# Altium schematic sheet VTM Ethernet Module.SchDoc
size A4; SheetNumber: 1; SheetTotal: 1
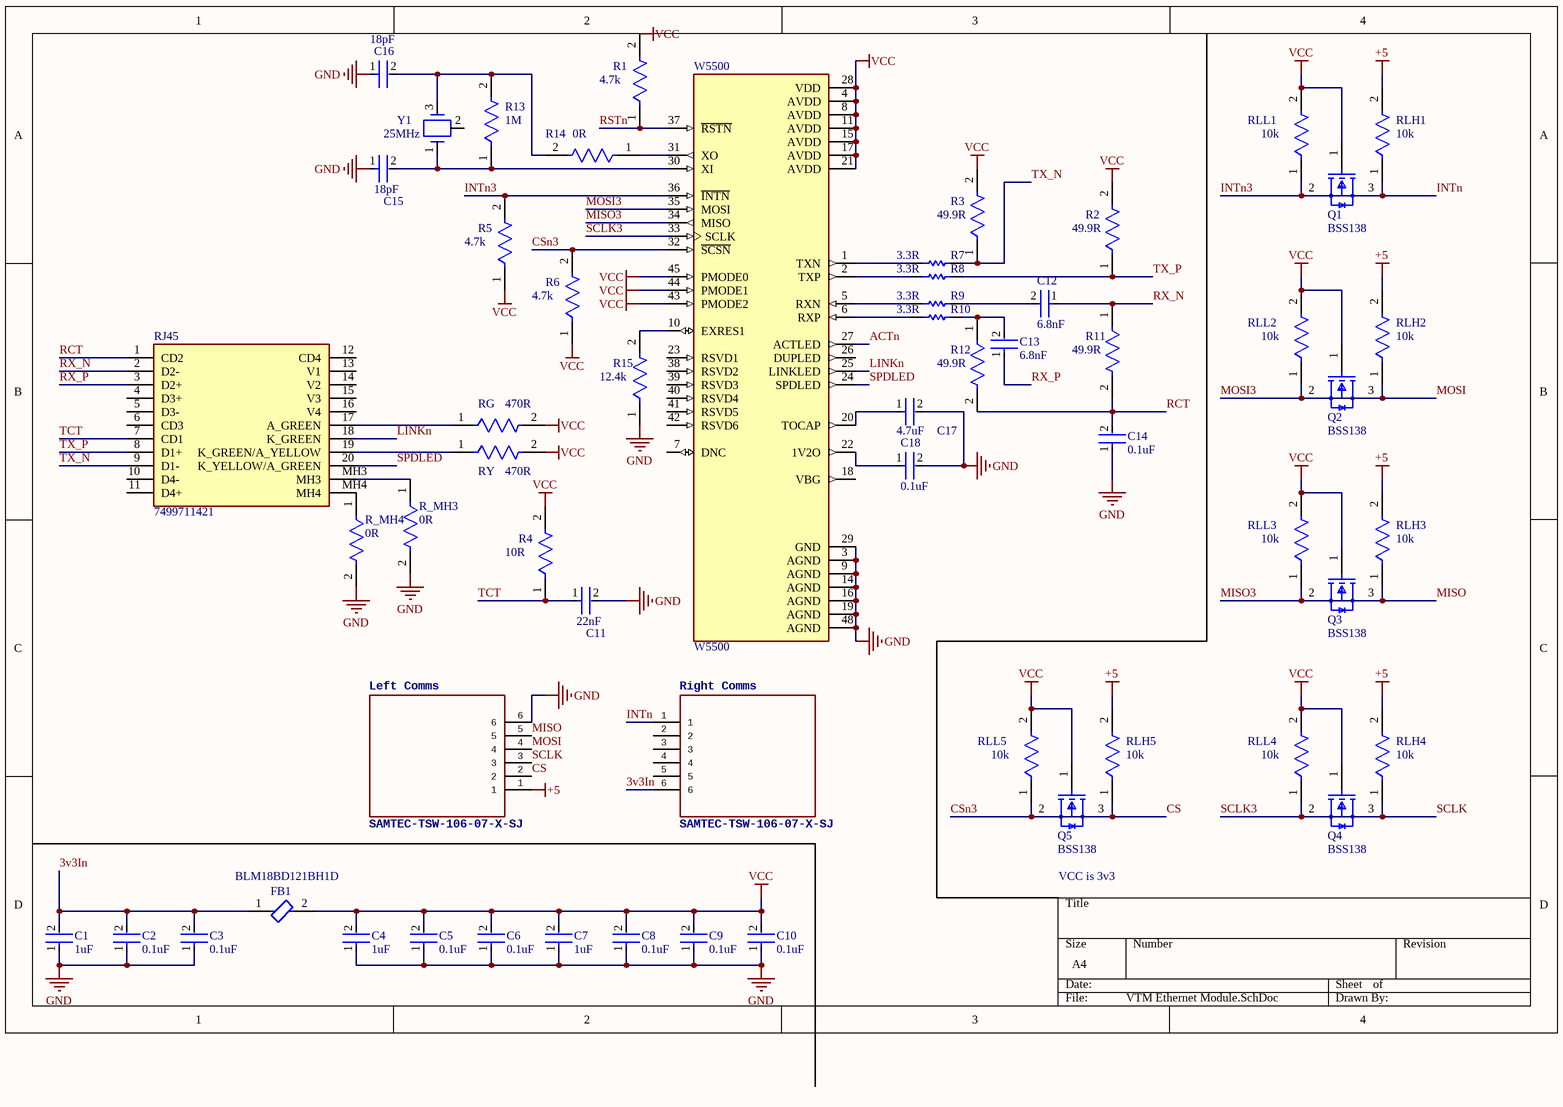
[diagram p0: VTM Ethernet Module.SchDoc]

## Parts
C1  1uF  [FP-C0805C-DN-MFG]
C2  0.1uF  [FP-C0805C-DN-MFG]
C3  0.1uF  [FP-C0805C-DN-MFG]
C4  1uF  [FP-C0805C-DN-MFG]
C5  0.1uF  [FP-C0805C-DN-MFG]
C6  0.1uF  [FP-C0805C-DN-MFG]
C7  1uF  [FP-C0805C-DN-MFG]
C8  0.1uF  [FP-C0805C-DN-MFG]
C9  0.1uF  [FP-C0805C-DN-MFG]
C10  0.1uF  [FP-C0805C-DN-MFG]
C11  22nF  [FP-C0805C-DN-MFG]
C12  6.8nF  [FP-C0805C-DN-MFG]
C13  6.8nF  [FP-C0805C-DN-MFG]
C14  0.1uF  [FP-C0805C-DN-MFG]
C15  18pF  [FP-C0805C-DN-MFG]
C16  18pF  [FP-C0805C-DN-MFG]
C17  4.7uF  [FP-C0805C-DN-MFG]
C18  0.1uF  [FP-C0805C-DN-MFG]
FB1  BLM18BD121BH1D  [FP-BLM18-0_15-t0_8-MFG]
Left_Comms  SAMTEC-TSW-106-07-X-SJ  [SAMTEC-TSW-106-07-X-S]
Q1  BSS138  [FP-318-08-IPC_B]
Q2  BSS138  [FP-318-08-IPC_B]
Q3  BSS138  [FP-318-08-IPC_B]
Q4  BSS138  [FP-318-08-IPC_B]
Q5  BSS138  [FP-318-08-IPC_B]
R1  4.7k  [FP-CPF0805-MFG]
R2  49.9R  [FP-CPF0805-MFG]
R3  49.9R  [FP-CPF0805-MFG]
R4  10R  [FP-CPF0805-MFG]
R5  4.7k  [FP-CPF0805-MFG]
R6  4.7k  [FP-CPF0805-MFG]
R7  3.3R  [RESC3216X70X50LL05T20]
R8  3.3R  [RESC3216X70X50LL05T20]
R9  3.3R  [RESC3216X70X50LL05T20]
R10  3.3R  [RESC3216X70X50LL05T20]
R11  49.9R  [FP-CPF0805-MFG]
R12  49.9R  [FP-CPF0805-MFG]
R13  1M  [FP-CPF0805-MFG]
R14  0R  [FP-CPF0805-MFG]
R15  12.4k  [FP-CPF0805-MFG]
R_MH3  0R  [FP-CPF0805-MFG]
R_MH4  0R  [FP-CPF0805-MFG]
RG  470R  [FP-CPF0805-MFG]
Right_Comms  SAMTEC-TSW-106-07-X-SJ  [SAMTEC-TSW-106-07-X-S]
RJ45  7499711421  [7499711421]
RLH1  10k  [FP-CPF0805-MFG]
RLH2  10k  [FP-CPF0805-MFG]
RLH3  10k  [FP-CPF0805-MFG]
RLH4  10k  [FP-CPF0805-MFG]
RLH5  10k  [FP-CPF0805-MFG]
RLL1  10k  [FP-CPF0805-MFG]
RLL2  10k  [FP-CPF0805-MFG]
RLL3  10k  [FP-CPF0805-MFG]
RLL4  10k  [FP-CPF0805-MFG]
RLL5  10k  [FP-CPF0805-MFG]
RY  470R  [FP-CPF0805-MFG]
W5500  W5500  [QFP50P900X900X160-48N]
Y1  25MHz  [ECS-4X-3IL]

## Nets
+5: Left_Comms.1 RLH1.2 RLH2.2 RLH3.2 RLH4.2 RLH5.2
GND: C1.1 C2.1 C3.1 C4.1 C5.1 C6.1 C7.1 C8.1 C9.1 C10.1 C11.2 C14.1 C15.1 C16.1 C17.2 C18.2 Left_Comms.6 R15.1 R_MH3.2 R_MH4.2 W5500.3(AGND) W5500.9(AGND) W5500.14(AGND) W5500.16(AGND) W5500.19(AGND) W5500.29(GND) W5500.48(AGND)
VCC: C4.2 C5.2 C6.2 C7.2 C8.2 C9.2 C10.2 FB1.2 Q1.1(G) Q2.1(G) Q3.1(G) Q4.1(G) Q5.1(G) R1.2 R2.2 R3.2 R4.2 R5.1 R6.1 RG.2 RLL1.2 RLL2.2 RLL3.2 RLL4.2 RLL5.2 RY.2 W5500.4(AVDD) W5500.8(AVDD) W5500.11(AVDD) W5500.15(AVDD) W5500.17(AVDD) W5500.21(AVDD) W5500.28(VDD) W5500.43(PMODE2) W5500.44(PMODE1) W5500.45(PMODE0)
3v3In: C1.2 C2.2 C3.2 FB1.1 Right_Comms.6
ACTn: W5500.27(ACTLED)
CS: Left_Comms.2 Q5.2(S) Q5.3(D) R6.2 RLH5.1 RLL5.1 W5500.32(~{SCSN})  [also labelled CSn3]
INTn: Q1.2(S) Q1.3(D) R5.2 Right_Comms.1 RLH1.1 RLL1.1 W5500.36(~{INTN})  [also labelled INTn3]
LINKn: RJ45.18(K_GREEN) W5500.25(LINKLED)
MISO: Left_Comms.5 Q3.2(S) Q3.3(D) RLH3.1 RLL3.1 W5500.34(MISO)  [also labelled MISO3]
MOSI: Left_Comms.4 Q2.2(S) Q2.3(D) RLH2.1 RLL2.1 W5500.35(MOSI)  [also labelled MOSI3]
RCT: C14.2 R11.2 R12.2 RJ45.1(CD2)
RSTn: R1.1 W5500.37(~{RSTN})
RX_N: C12.1 R11.1 RJ45.2(D2-)
RX_P: C13.1 RJ45.3(D2+)
SCLK: Left_Comms.3 Q4.2(S) Q4.3(D) RLH4.1 RLL4.1 W5500.33(SCLK)  [also labelled SCLK3]
SPDLED: RJ45.20(K_YELLOW/A_GREEN) W5500.24(SPDLED)
TCT: C11.1 R4.1 RJ45.7(CD1)
TX_N: R3.1 R7.2 RJ45.9(D1-)
TX_P: R2.1 R8.2 RJ45.8(D1+)
NetC12_2: C12.2 R9.2
NetC13_2: C13.2 R10.2 R12.1
NetC15_2: C15.2 R13.1 W5500.30(XI) Y1.1
NetC16_2: C16.2 R13.2 R14.2 Y1.3
NetC17_1: C17.1 W5500.20(TOCAP)
NetC18_1: C18.1 W5500.22(1V2O)
NetR7_1: R7.1 W5500.1(TXN)
NetR8_1: R8.1 W5500.2(TXP)
NetR9_1: R9.1 W5500.5(RXN)
NetR10_1: R10.1 W5500.6(RXP)
NetR14_1: R14.1 W5500.31(XO)
NetR15_2: R15.2 W5500.10(EXRES1)
NetR_MH3_1: R_MH3.1 RJ45.MH3
NetR_MH4_1: R_MH4.1 RJ45.MH4
NetRG_1: RG.1 RJ45.17(A_GREEN)
NetRJ45_19: RJ45.19(K_GREEN/A_YELLOW) RY.1

Not connected (* = marked no-connect by the designer): Right_Comms 2 3 4 5; RJ45 4(D3+) 5(D3-) 6(CD3) 10(D4-) 11(D4+) 12(CD4) 13(V1) 14(V2) 15(V3) 16(V4); W5500 7(DNC) 18(VBG) 23(RSVD1) 26(DUPLED) 38(RSVD2) 39(RSVD3) 40(RSVD4) 41(RSVD5) 42(RSVD6); Y1 2

## Notes on the sheet
- VCC is 3v3

## Library data of the parts
C1-C18 = CMP-1036-01133-2: CAP CER 18PF 25V 20% NP0 0805; Manufacturer Part Number: C0805C180M3GACTU; Manufacturer: KEMET; Material: Ceramic; Temperature Characteristic: C0G; Tolerance: 0.2; Temperature Coefficient: 30ppm/°C; Automotive: No; Temperature: -55°C to +125°C; Package: C0805C-DN; Device Class L3: Ceramic Capacitors; Capacitance: 18 pF; Octopart: https://octopart.com/c0805c180m3gactu-kemet-17137232; ComponentLink2Description: Datasheet; RoHS: TRUE; Device Class L1: Passive Components; Voltage Rating: 25 V; Height: 0.88mm; Ipc Land Pattern Name: CAPC200125X78; Device Class L2: Capacitors; Mouser Description: Multilayer Ceramic Capacitors MLCC - SMD/SMT 25volts 18pF C0G 20%; Category: Cap; Temperature Range High: +125°C; Temperature Range Low: -55°C; Lead Free: Yes; Digikey Description: CAP CER 18PF 25V 20% NP0 0805; Value: 18 pF; ComponentLink2URL: https://content.kemet.com/datasheets/KEM_C1003_C0G_SMD.pdf
FB1 = CMP-06046-002548-1: Chip Ferrite Bead, 0603, 120Ω @ 100MHz, 0.4Ω, 25%, 300mA; Number of Lines: 1; DC Resistance (DCR): 400mR; Case/Package: 0603; Max Current Rating: 300mA; Ratings: AEC-Q200; Case Code (Metric): 1608; Min Operating Temperature: -55°C; Max Operating Temperature: 150°C; Case Code (Imperial): 0603; RoHS Compliant: Yes
Q1-Q5 = CMP-07173-000101-1: MOSFET N-CH 50V 220MA SOT-23; Turn-Off Delay Time: 20ns; Element Configuration: Single; Rds On Max: 3.5R; Gate to Source Voltage (Vgs): 20V; Threshold Voltage: 1.3V; Number of Elements: 1; Power Dissipation: 360mW; Rise Time: 9ns; Turn-On Delay Time: 2.5ns; Input Capacitance: 27pF; On-State Resistance: 6R; Lead Free: Lead Free; Length: 2.92mm; Width: 1.3mm; Drain to Source Breakdown Voltage: 50V; Min Operating Temperature: -55°C; REACH SVHC: No SVHC; Packaging: Tape and Reel; Radiation Hardening: No; Height: 0.93mm; Drain to Source Voltage (Vdss): 50V; Current Rating: 220mA; Voltage Rating (DC): 50V; Weight: 0.03g; Continuous Drain Current (ID): 220mA; Number of Pins: 3; Nominal Vgs: 1.3V; Max Power Dissipation: 360mW; Fall Time: 9ns; Drain to Source Resistance: 3.5R; Contact Plating: Tin; Case/Package: SOT-23; Package Quantity: 1; Dual Supply Voltage: 50V; Mount: Surface Mount; Termination: SMD/SMT; Max Operating Temperature: 150°C
R1-R6 R11-R15 R_MH3 R_MH4 RG RLH1-RLH5 RLL1-RLL5 RY = CMP-03211-011426-1: RES SMD 1.6M OHM 0.1% 1/10W 0805; Resistance: 1.6MR; Voltage Rating: 100V; Temperature Coefficient: 25ppm/°C; Max Power Dissipation: 100mW; Number of Resistors: 1; Length: 2mm; Number of Terminations: 2; Resistor Type: Thin Film; Weight: 0.000194oz; Case Code (Imperial): 0805; Series: CPF, Neohm; RoHS Compliant: Yes; Width: 1.25mm; Mount: Surface Mount; Package Quantity: 1000; Height: 0.55mm; Case/Package: 0805; Min Operating Temperature: -55°C; Termination: Solder; ELV: Compliant; Packaging: Tape and Reel; Case Code (Metric): 2012; Tolerance: 0.1%; Max Operating Temperature: 155°C; Power Rating: 100mW
R7-R10 = CMP-2003-00687-1: Part Number: ERJ-8RQF3R3V; Manufacturer: Panasonic
RJ45 = 7499711421: Connector; Manufacturer_Name: Wurth Elektronik; Datasheet Link: https://www.we-online.com/catalog/datasheet/7499711421.pdf; Height: 13.87mm; Manufacturer_Part_Number: 7499711421; Mouser Part Number: 710-7499711421; Mouser Price/Stock: https://www.mouser.co.uk/ProductDetail/Wurth-Elektronik/7499711421?qs=ljCeji4nMDkSFYeFRPO9OA%3D%3D
W5500 = W5500: Ethernet Controller 10/100 Base-T/TX PHY SPI Interface 48-LQFP (7x7); MF: WIZnet; Value: *; Package: None; Check_prices: https://www.snapeda.com/parts/W5500/WIZnet/view-part/?ref=eda; Price: None; MP: W5500; Availability: In Stock; SnapEDA_Link: https://www.snapeda.com/parts/W5500/WIZnet/view-part/?ref=snap; Purchase-URL: https://pricing.snapeda.com/search/part/W5500/?ref=eda
Y1 = CMP-1669-00002-2: CRYSTAL 8.00 MHZ 20PF 49US; PartNumber: ECS-80-20-4X; Manufacturer: ECS; ComponentLink1URL: http://www.ecsxtal.com/store/pdf/hc-49usx.pdf; ComponentLink1Description: Datasheet; PackageReference: 4X-3IL